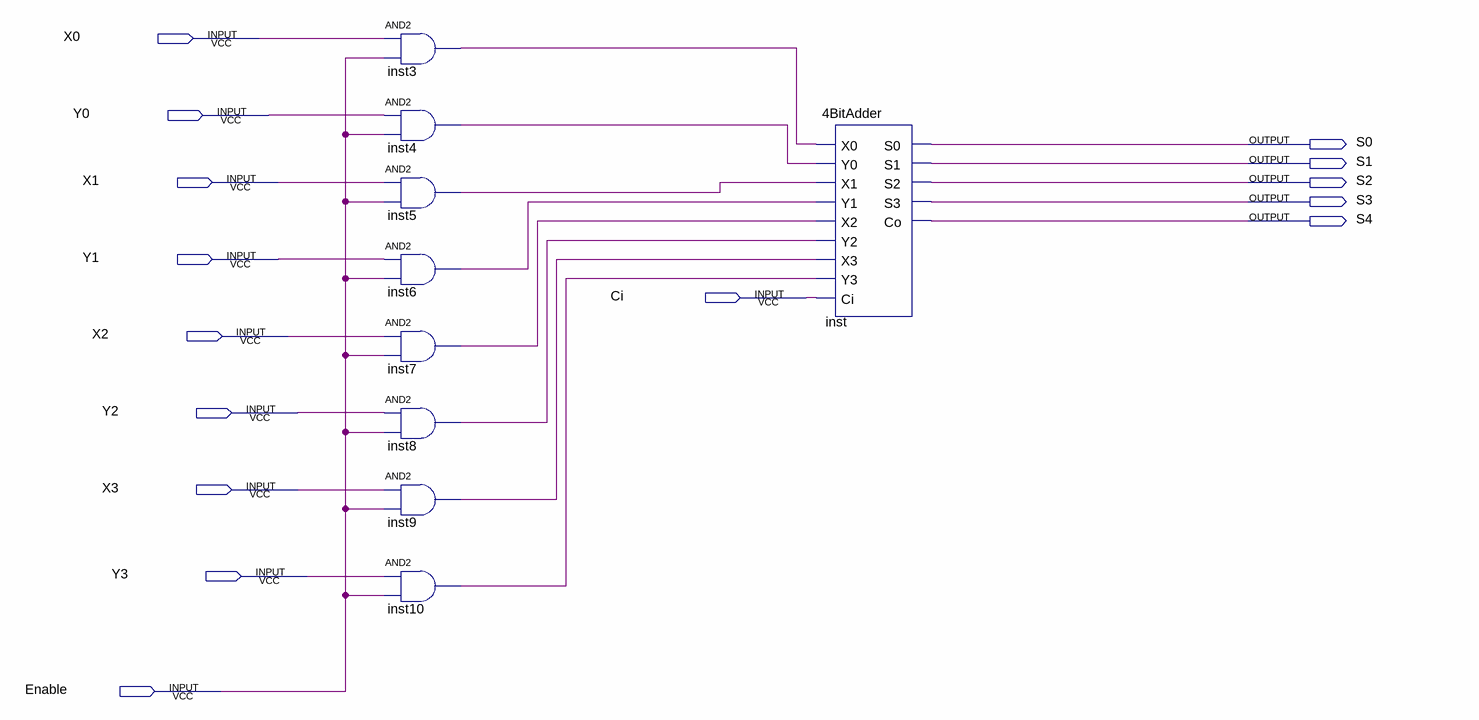
[diagram p0: schematic sheet]
// Quartus schematic PWA.bdf as structural Verilog: 9 symbols, 15 pins
module PWA (
  input  X0,
  input  Y0,
  input  X1,
  input  Y1,
  input  Ci,
  input  X2,
  input  Y2,
  input  X3,
  input  Y3,
  input  Enable,
  output S0,
  output S1,
  output S2,
  output S3,
  output S4
);

  wire inst3_out, inst4_out, inst5_out, inst6_out, inst7_out, inst8_out, inst9_out, inst10_out;

  and inst3 (inst3_out, X0, Enable);
  and inst4 (inst4_out, Y0, Enable);
  and inst5 (inst5_out, X1, Enable);
  and inst6 (inst6_out, Y1, Enable);
  and inst7 (inst7_out, X2, Enable);
  and inst8 (inst8_out, Y2, Enable);
  and inst9 (inst9_out, X3, Enable);
  and inst10 (inst10_out, Y3, Enable);
  \4BitAdder  inst (
    .X0(inst3_out), .Y0(inst4_out), .X1(inst5_out), .Y1(inst6_out), .X2(inst7_out), .Y2(inst8_out),
    .X3(inst9_out), .Y3(inst10_out), .Ci(Ci), .S0(S0), .S1(S1), .S2(S2), .S3(S3), .Co(S4));
endmodule
